# Altium project 210806300163-李烨攀-单片机局部电路.PrjPcb
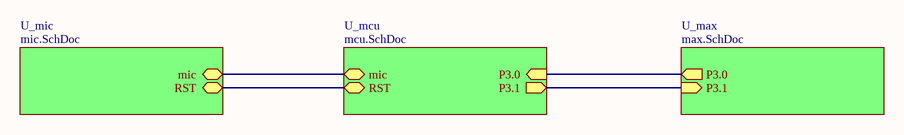
[diagram p0: 单片机局部电路.SchDoc]
4 sheets, 16 parts. Net scope: hierarchical (ports join the sheet entries above them; power ports are global).
Sheets:
  单片机局部电路.SchDoc
    U_mic = mic.SchDoc
    U_mcu = mcu.SchDoc
    U_max = max.SchDoc

## Sheet 单片机局部电路.SchDoc
size A4; Time: 22/04/18

### Sub-sheets
U_max = max.SchDoc: P3.1 (in), P3.0 (out)
U_mcu = mcu.SchDoc: RST (bidir), mic (bidir), P3.0 (in), P3.1 (out)
U_mic = mic.SchDoc: mic (bidir), RST (bidir)

### Nets
NetQ1_2: sheet U_mic/mic, sheet U_mcu/mic
NetR1_2: sheet U_mic/RST, sheet U_mcu/RST
NetU1_11: sheet U_mcu/P3.1, sheet U_max/P3.1
NetU1_12: sheet U_mcu/P3.0, sheet U_max/P3.0

### Notes on the sheet
- 专升本
- 通信工程
- 李烨攀
- 2101班
- 210806300163
- 学号

## Sheet mic.SchDoc
size A4; Time: 22/04/18
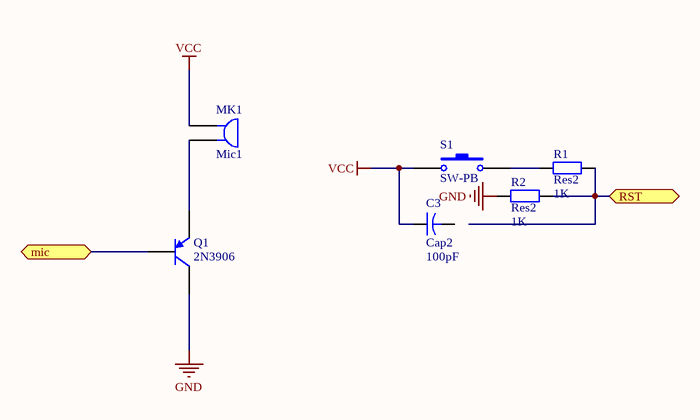
[diagram p1: mic.SchDoc]

### Parts
C3  Cap2  value 100pF  [CAPR5-4X5]
MK1  Mic1  [PIN2]
Q1  2N3906  [TO-92A]
R1  Res2  value 1K  [AXIAL-0.4]
R2  Res2  value 1K  [AXIAL-0.4]
S1  SW-PB  [SPST-2]

### Ports
mic (bidir), RST (bidir)

### Nets
GND: Q1.3(C) R2.1
VCC: C3.1 MK1.1 S1.1
NetMK1_2: MK1.2 Q1.1(E)
NetQ1_2: Q1.2(B) ; port mic
NetR1_1: R1.1 S1.2
NetR1_2: R1.2 R2.2 ; port RST

Not connected (* = marked no-connect by the designer): C3 2

### Notes on the sheet
- 专升本
- 通信工程
- 李烨攀
- 2101班
- 210806300163
- 学号

### Library data of the parts
C3 = Cap2: Capacitor; Published: 23-Sep-2002; PackageReference: CAPR5-4X5; Publisher: Altium Limited; PackageDescription: Capacitor; 2 Leads
MK1 = Mic1: Microphone; Published: 24-Mar-1999; LatestRevisionDate: 17-Jul-2002; LatestRevisionNote: Re-released for DXP Platform.; PackageReference: PIN2; Publisher: Altium Limited
Q1 = 2N3906: PNP General Purpose Amplifier; Published: 8-Jun-2000; LatestRevisionDate: 15-Jan-2003; LatestRevisionNote: PCB Footprint 'BCY-W3/D4.7' replaced; DatasheetVersion: 1997; PackageVersion: Sep-1998; PackageReference: TO-92A; Publisher: Altium Limited; PackageDescription: TO, Flat Index; 3 In-Line, Axial Leads; Body Dia. 4.5mm; Leads 0.51 x 0.48 mm (max); ComponentLink1Description: Manufacturer Link; ComponentLink1URL: http://www.fairchildsemi.com/; ComponentLink2Description: Datasheet; ComponentLink2URL: http://www.fairchildsemi.com/ds/2N%2F2N3906.pdf
R1 R2 = Res2: Resistor; Published: 8-Jun-2000; LatestRevisionDate: 17-Jul-2002; LatestRevisionNote: Re-released for DXP Platform.; PackageReference: AXIAL-0.4; Publisher: Altium Limited; PackageDescription: Axial Device, Thru-Hole; 2 Leads; 0.4 in Pin Spacing
S1 = SW-PB: Switch; Published: 24-Mar-1999; LatestRevisionDate: 17-Jul-2002; LatestRevisionNote: Re-released for DXP Platform.; PackageReference: SPST-2; Publisher: Altium Limited; PackageDescription: Switch; 2 Leads

## Sheet mcu.SchDoc
size A4; Time: 22/04/18
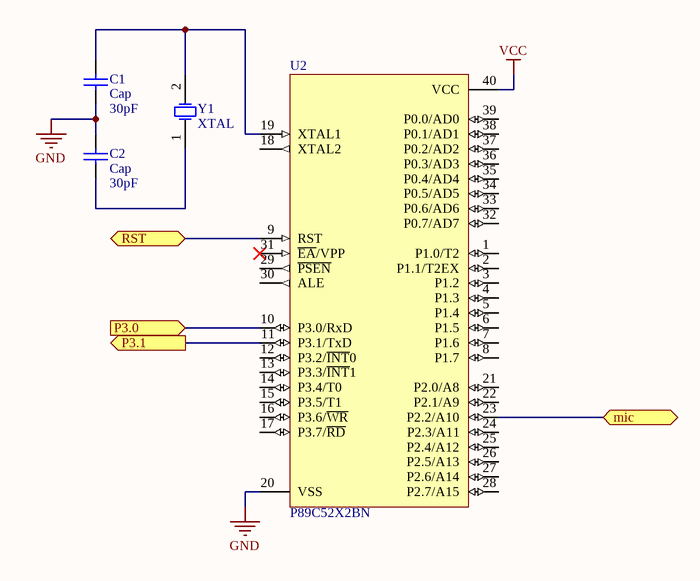
[diagram p2: mcu.SchDoc]

### Parts
C1  Cap  value 30pF  [RAD-0.3]
C2  Cap  value 30pF  [RAD-0.3]
U2  P89C52X2BN  [SOT129-1]
Y1  XTAL  [R38]

### Ports
mic (bidir), P3.0 (in), P3.1 (out), RST (bidir)

### Nets
GND: C1.1 C2.2 U2.20(VSS)
VCC: U2.40(VCC)
NetC1_2: C1.2 U2.19(XTAL1) Y1.2(OSC2)
NetC2_1: C2.1 Y1.1(OSC1)
NetQ1_2: U2.23(P2.2/A10) ; port mic
NetR1_2: U2.9(RST) ; port RST
NetU1_11: U2.11(P3.1/TxD) ; port P3.1
NetU1_12: U2.10(P3.0/RxD) ; port P3.0

Not connected (* = marked no-connect by the designer): U2 1(P1.0/T2) 2(P1.1/T2EX) 3(P1.2) 4(P1.3) 5(P1.4) 6(P1.5) 7(P1.6) 8(P1.7) 12(P3.2/~{INT}0) 13(P3.3/~{INT}1) 14(P3.4/T0) 15(P3.5/T1) 16(P3.6/~{WR}) 17(P3.7/~{RD}) 18(XTAL2) 21(P2.0/A8) 22(P2.1/A9) 24(P2.3/A11) 25(P2.4/A12) 26(P2.5/A13) 27(P2.6/A14) 28(P2.7/A15) 29(~{PSEN}) 30(ALE) 31(~{EA}/VPP)* 32(P0.7/AD7) 33(P0.6/AD6) 34(P0.5/AD5) 35(P0.4/AD4) 36(P0.3/AD3) 37(P0.2/AD2) 38(P0.1/AD1) 39(P0.0/AD0)

### Notes on the sheet
- 专升本
- 通信工程
- 李烨攀
- 2101班
- 210806300163
- 学号

### Library data of the parts
C1 C2 = Cap: Capacitor; Published: 8-Jun-2000; LatestRevisionDate: 17-Jul-2002; LatestRevisionNote: Re-released for DXP Platform.; PackageReference: RAD-0.3; Publisher: Altium Limited; PackageDescription: Radial Cap, Thru-Hole; 2 Leads; 0.3 in Pin Spacing
U2 = P89C52X2BN: 80C51 8-Bit Flash Microcontroller Family, 8 kB Flash; Published: 21-May-2003; DatasheetVersion: 5-Jun-2002; PackageVersion: Aug-2000; PackageReference: SOT129-1; Publisher: Altium Limited; PackageDescription: DIP, Plastic; 40 Leads; Row Spacing 15.24 mm; Pitch 2.54 mm; Code_JEDEC: MO-015; ComponentLink1Description: Manufacturer Link; ComponentLink1URL: http://www-us2.semiconductors.philips.com/; ComponentLink2Description: Datasheet; ComponentLink2URL: http://www.semiconductors.philips.com/acrobat/datasheets/P89C5XX2_2.pdf
Y1 = XTAL: Crystal Oscillator; Published: 8-Jun-2000; LatestRevisionDate: 17-Jul-2002; LatestRevisionNote: Re-released for DXP Platform.; PackageReference: R38; Publisher: Altium Limited; PackageDescription: Crystal, Thru-Hole; 2 Leads; Body 3.1 x 8.2 mm (Dia.xH)

## Sheet max.SchDoc
size A4; Time: 22/04/18
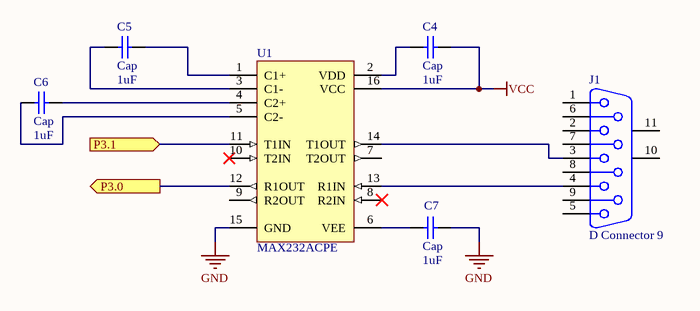
[diagram p3: max.SchDoc]

### Parts
C4  Cap  value 1uF  [RAD-0.3]
C5  Cap  value 1uF  [RAD-0.3]
C6  Cap  value 1uF  [RAD-0.3]
C7  Cap  value 1uF  [RAD-0.3]
J1  D Connector 9  [DSUB1.385-2H9]
U1  MAX232ACPE  [PE16A]

### Ports
P3.0 (out), P3.1 (in)

### Nets
GND: C7.2 U1.15(GND)
VCC: C4.2 U1.16(VCC)
NetC4_1: C4.1 U1.2(VDD)
NetC5_1: C5.1 U1.3(C1-)
NetC5_2: C5.2 U1.1(C1+)
NetC6_1: C6.1 U1.5(C2-)
NetC6_2: C6.2 U1.4(C2+)
NetC7_1: C7.1 U1.6(VEE)
NetJ1_3: J1.3 U1.14(T1OUT)
NetJ1_4: J1.4 U1.13(R1IN)
NetU1_11: U1.11(T1IN) ; port P3.1
NetU1_12: U1.12(R1OUT) ; port P3.0

Not connected (* = marked no-connect by the designer): J1 1 2 5 6 7 8 9 10(MH1) 11(MH2); U1 7(T2OUT) 8(R2IN)* 9(R2OUT) 10(T2IN)*

### Notes on the sheet
- 专升本
- 通信工程
- 李烨攀
- 2101班
- 210806300163
- 学号

### Library data of the parts
C4-C7 = Cap: Capacitor; Published: 8-Jun-2000; LatestRevisionDate: 17-Jul-2002; LatestRevisionNote: Re-released for DXP Platform.; PackageReference: RAD-0.3; Publisher: Altium Limited; PackageDescription: Radial Cap, Thru-Hole; 2 Leads; 0.3 in Pin Spacing
J1 = D Connector 9: Receptacle Assembly, 9 Position, Right Angle; PackageDocument: O; Positions: 9; Published: 15-Jun-2001; LatestRevisionDate: 17-Jul-2002; LatestRevisionNote: Re-released for DXP Platform.; DatasheetDocument: 1-Sep-1999; PackageReference: 788750; Publisher: Altium Limited; Orientation: Right Angle; Gender: Receptacle
U1 = MAX232ACPE: +5V Powered, Multi-Channel RS-232 Driver/Receiver; Published: 16-Jan-2001; LatestRevisionDate: 29-May-2009; LatestRevisionNote: Component Body Added.; PackageVersion: 1997; PackageReference: PE16A; Publisher: Altium Limited; PackageDescription: DIP, 16-Pin, Row Spacing 7.62 mm, Pitch 2.54 mm; Code_JEDEC: MS-001-BB; ComponentLink1Description: Manufacturer Link; ComponentLink1URL: http://www.maxim-ic.com/; ComponentLink2Description: Datasheet; ComponentLink2URL: http://pdfserv.maxim-ic.com/en/ds/MAX220-MAX249.pdf

## Nets that join several sheets
GND: mic (Q1.3 R2.1), mcu (C1.1 C2.2 U2.20), max (C7.2 U1.15)
VCC: mic (C3.1 MK1.1 S1.1), mcu (U2.40), max (C4.2 U1.16)
NetQ1_2: mic (Q1.2), mcu (U2.23)
NetR1_2: mic (R1.2 R2.2), mcu (U2.9)
NetU1_11: mcu (U2.11), max (U1.11)
NetU1_12: mcu (U2.10), max (U1.12)